# EasyEDA Pro project Main.eprj, board k230D
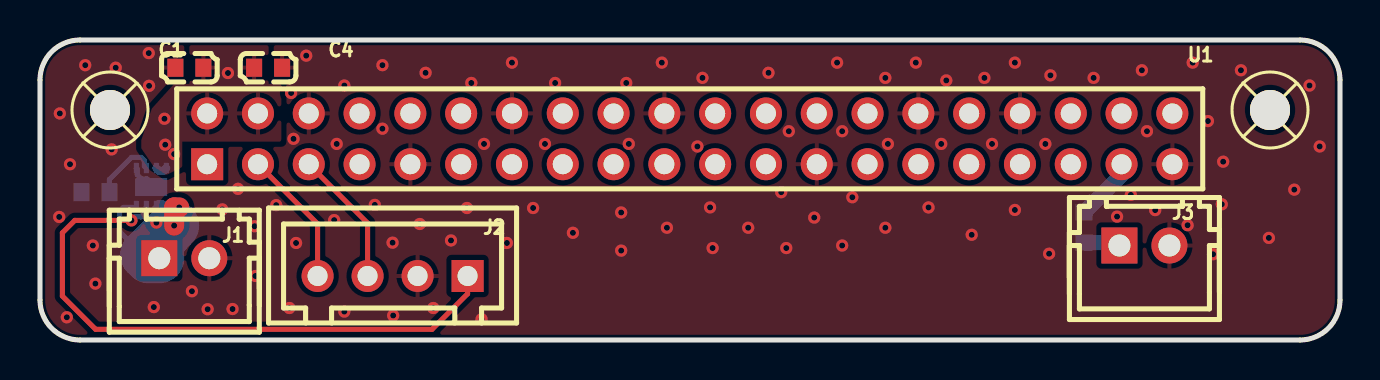
[diagram p12: board, top side]
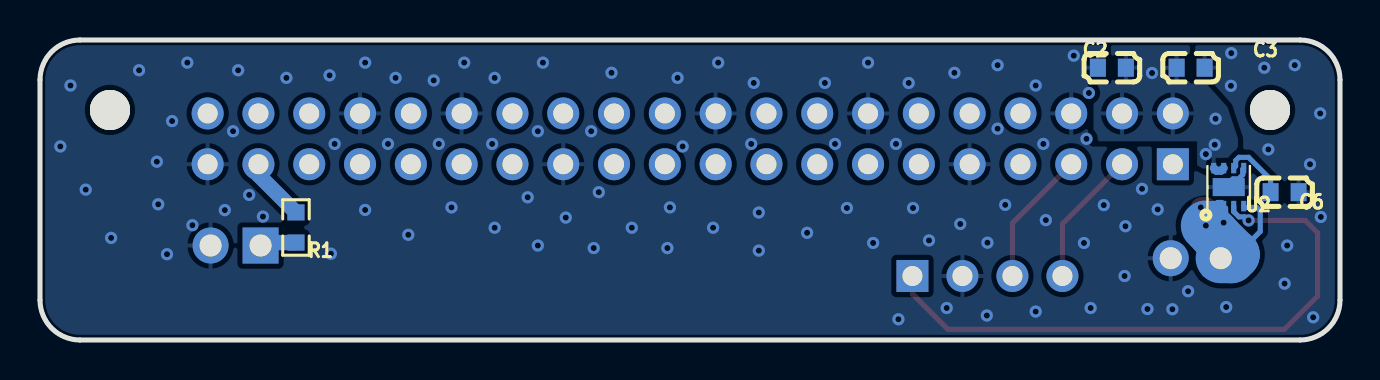
[diagram p13: board, bottom side, seen from below]

Outline 65 x 15 mm; copper layers: Top Layer, Bottom Layer. Coordinates in mm from the lower left corner of the outline.
Outline path: 0,13 arc(0.59,14.41) 2,15 63,15 arc(64.41,14.41) 65,13 65,2 arc(64.41,0.59) 63,0 2,0 arc(0.59,0.59) 0,2 0,13
Stack: Top Layer 0.035mm / Dielectric1 1.51mm FR4 er 4.5 / Bottom Layer 0.035mm

## Design rules (mm)
template: Custom Config
spacing copperThickness1oz (default): track to track 0.102, other pairs 0.152 to 0.3
spacing copperThickness2oz: track to track 0.203, other pairs 0.152 to 0.3
track width copperThickness1oz (default): min 0.127, default 0.254, max 7
track width copperThickness2oz: min 0.203, default 0.254, max 7
differential pair differentialPair (default): width min 0.127, default 0.254, max 2.54; gap min 0.152, default 0.152
via viaSize (default): diameter min 0.5, default 0.61, max 10; hole min 0.3, default 0.305, max 6.3

## Placement (name value [footprint] x y rotation side)
C1  100nF  [C0603]  7.47 13.61 180 top
C2  1uF  [C0603]  11.41 13.61 0 bottom
C3  22uF  [C0603]  7.47 13.61 180 bottom
C4  47uF  [C0603]  11.41 13.61 0 top
C6  10nF  [C0603]  2.77 7.39 0 bottom
J1  K230 pow  [CONN-TH_2P-P2.50_HX25003-2A]  7.22 4.09 0 top
J2  k230D UART  [CONN-TH_B4B-XH-A-BK-LF-SN]  17.63 3.2 180 top
J3  K230 buzzer  [CONN-TH_2P-P2.50_HX25003-2A]  55.22 4.72 0 top
R1  1kΩ  [R0603]  52.2 5.63 90 bottom
SCREW2  -  [Screw-Hole-M2]  61.5 11.5 180 top
SCREW4  -  [Screw-Hole-M2]  3.5 11.5 180 top
U1  FH-00148  [HDR-TH_40P-P2.54_FFH25405-D40S1001K6K]  32.49 10.06 0 top
U2  TPS22975DSGR  [WSON-8_L2.0-W2.0-P0.50-TL-EP]  5.56 7.64 90 bottom

## Footprints (pads in the part's own frame, mm; a bottom-side part is the same pattern mirrored in y, then rotated)
C0603
  rect 0.8x0.9 smd: 1(-0.7,0) 2(0.7,0)
CONN-TH_2P-P2.50_HX25003-2A
  rect 1.8x1.8 hole 1.1: 1(-1.25,0)
  round 1.8 hole 1.1: 2(1.25,0)
CONN-TH_B4B-XH-A-BK-LF-SN
  rect 1.6x1.6 hole 1: 1(-3.75,0)
  round 1.6 hole 1: 2(-1.25,0) 3(1.25,0) 4(3.75,0)
HDR-TH_40P-P2.54_FFH25405-D40S1001K6K
  rect 1.6x1.6 hole 1: 1(-24.13,-1.27)
  round 1.6 hole 1: 2(-24.13,1.27) 3(-21.59,-1.27) 4(-21.59,1.27) 5(-19.05,-1.27) 6(-19.05,1.27) 7(-16.51,-1.27) 8(-16.51,1.27) 9(-13.97,-1.27) 10(-13.97,1.27) 11(-11.43,-1.27) 12(-11.43,1.27) 13(-8.89,-1.27) 14(-8.89,1.27) 15(-6.35,-1.27) 16(-6.35,1.27) 17(-3.81,-1.27) 18(-3.81,1.27) 19(-1.27,-1.27) 20(-1.27,1.27) 21(1.27,-1.27) 22(1.27,1.27) 23(3.81,-1.27) 24(3.81,1.27) 25(6.35,-1.27) 26(6.35,1.27) 27(8.89,-1.27) 28(8.89,1.27) 29(11.43,-1.27) 30(11.43,1.27) 31(13.97,-1.27) 32(13.97,1.27) 33(16.51,-1.27) 34(16.51,1.27) 35(19.05,-1.27) 36(19.05,1.27) 37(21.59,-1.27) 38(21.59,1.27) 39(24.13,-1.27) 40(24.13,1.27)
R0603
  rect 0.806x0.864 smd: 1(-0.753,0) 2(0.753,0)
Screw-Hole-M2
  round 2 hole 2: 1(0,0)
WSON-8_L2.0-W2.0-P0.50-TL-EP
  rect 0.521x0.25 smd: 1(-0.95,0.75) 2(-0.95,0.25) 3(-0.95,-0.25) 4(-0.95,-0.75) 5(0.95,-0.75) 6(0.95,-0.25) 7(0.95,0.25) 8(0.95,0.75)
  rect 0.9x1.6 smd: 9(0,0)

## Nets
+5V: J1.1 U2.1 U2.2 U2.4
K230_ENABLE: J2.1 U2.3
K230D_BUZZER: R1.2 U1.37
K230RX: J2.4 U1.3
K230TX: J2.3 U1.5
POWER_GND: C1.2 C2.2 C3.2 C4.2 C6.1 J1.2 J2.2 J3.2 U1.6 U1.9 U1.14 U1.20 U1.25 U1.30 U1.34 U1.39 U2.5 U2.9
$1N12541: C1.1 C2.1 C3.1 C4.1 U1.2 U1.4 U2.7 U2.8
$1N12598: J3.1 R1.1
$1N87576: C6.2 U2.6

Pads without a net: SCREW2 1; SCREW4 1; U1 1 7 8 10 11 12 13 15 16 17 18 19 21 22 23 24 26 27 28 29 31 32 33 35 36 38 40

## Via types
v1: diameter 0.61, hole 0.305, Top Layer to Bottom Layer, 108 vias

## Routing (per net, layer and track width the routed paths; a pad name or vN(x,y) marks a point on that pad's centre or on a via; arc(x,y) is an arc through that point)
+5V: length 7.3
  Top Layer w1: v1(6.71,5.72) 6.71,6.63 v1(6.96,6.63)
  Bottom Layer w0.254: 4.57,4.84 3.99,5.42 3.99,6.45 4.17,6.63 4.75,6.63 U2.4 ; 5.72,6.6 5.72,6.38
  Bottom Layer w0.4: 5.92,6.8 6.09,6.8 6.2,6.69
  Bottom Layer w2.5: J1.1 5.45,4.09 5.26,4.27 5.28,4.27 6.28,5.27 6.28,5.29 v1(6.71,5.72)
  vias: v1(5.82,5.87)
K230_ENABLE: length 30.6
  Top Layer w0.254: v1(4.57,5.98) 1.74,5.98 1.12,5.36 1.12,2.2 2.78,0.53 19.6,0.53 21.38,2.31 J2.1
  Bottom Layer w0.254: v1(4.57,5.98) 4.6,5.98 4.77,6.16 5.05,6.16 5.31,6.42 U2.3
K230D_BUZZER: length 3.2
  Bottom Layer w0.762: U1.37 54.08,8.25 52.2,6.38
K230RX: length 6.8
  Top Layer w0.254: U1.3 13.88,5.81 J2.4
K230TX: length 6.8
  Top Layer w0.254: U1.5 16.38,5.85 J2.3
POWER_GND: length 1.4
  Bottom Layer w0.254: U2.9 5.56,7.84 5.35,8.06 5.07,8.06 4.86,8.27 4.86,8.55 U2.5
  vias: v1(0.99,11.33) v1(0.96,6.15) v1(1.34,1.14) v1(1.5,8.79) v1(2.26,13.74) v1(2.64,4.72) v1(2.77,2.82) v1(3.58,9.53) v1(3.79,13.61) v1(5.44,14.34) v1(5.45,12.71) v1(5.69,1.65) v1(7.6,2.44) v1(8.38,1.54) v1(9.12,6.53) v1(9.63,1.55) v1(9.9,7.56) v1(10.73,5.69) v1(10.77,3.2) v1(11.81,6.75) v1(12.47,1.6) v1(12.56,12.35) v1(12.68,10.06) v1(12.8,4.85) v1(13.31,14.22) v1(14.71,5.99) v1(14.84,9.8) v1(15.22,12.72) v1(15.22,1.42) v1(16.74,6.76) v1(17.12,13.74) v1(17.12,10.57) v1(17.63,4.87) v1(17.66,1.22) v1(18.99,5.8) v1(19.28,13.36) v1(19.66,1.6) v1(20.55,4.98) v1(21.35,6.6) v1(21.57,12.85) v1(22.08,1.04) v1(22.2,9.8) v1(23.34,4.85) v1(23.6,13.87) v1(24.66,6.6) v1(25.25,9.8) v1(25.76,12.85) v1(26.65,5.36) v1(29.06,6.38) v1(29.06,4.47) v1(29.31,12.85) v1(29.44,9.8) v1(31.09,13.87) v1(31.34,5.61) v1(32.87,9.68) v1(33.12,13.11) v1(33.5,6.63) v1(33.63,4.6) v1(35.41,5.61) v1(36.43,13.36) v1(37.06,7.39) v1(37.31,4.6) v1(37.44,10.44) v1(38.71,6.12) v1(39.85,13.87) v1(40.11,10.44) v1(40.11,4.72) v1(40.62,7.14) v1(42.27,13.11) v1(42.27,5.61) v1(42.39,9.8) v1(43.79,13.87) v1(44.43,6.63) v1(45.06,9.8) v1(45.31,12.98) v1(46.59,5.26) v1(47.22,13.11) v1(47.6,9.8) v1(48.74,13.87) v1(48.74,6.5) v1(50.27,9.8) v1(50.52,13.23) v1(50.46,4.31) v1(52.68,13.11) v1(53.85,6.17) v1(54.54,7.25) v1(55.09,13.49) v1(55.35,10.44) v1(55.76,6.49) v1(57.38,5.74) v1(57.63,13.87) v1(58.4,10.95) v1(58.65,4.29) v1(59.09,6.79) v1(59.16,8.92) v1(60.05,13.49) v1(61.44,5.11) v1(62.71,7.52) v1(63.48,12.72) v1(63.98,9.68)
$1N12541: length 0.6
  Bottom Layer w0.4: U2.7 5.95,8.46 6.18,8.46 U2.8
  vias: v1(6.22,11.06) v1(6.26,9.77) v1(6.71,9.3) v1(9.4,13.35)
$1N12598: length 1.9
  Bottom Layer w0.762: R1.1 53.57,4.87 53.97,4.47
$1N87576: length 3.3
  Bottom Layer w0.254: C6.2 3.47,8.03 4.57,9.13 5.05,9.13 5.22,8.97 5.22,8.69 U2.6

## Copper pours and planes (outline as drawn; the poured copper is in the pictures)
POWER_GND on Top Layer: -4.95,19.19 73.28,19.19 73.28,-8.5 -4.95,-8.5
POWER_GND on Bottom Layer: -4.06,18.68 71.63,18.68 71.63,-7.48 -4.06,-7.48
$1N12541 on Top Layer: 6.71,12.81 12.06,12.81 12.06,9.92 6.71,9.92
$1N12541 on Top Layer: 7.47,15 11.43,15 11.43,12.21 7.47,12.21
$1N12541 on Top Layer: 6.79,12.9 5.59,11.57 5.06,9.99 5.06,9.58 5.68,8.68 6.31,8.25 7.11,8.65 7.11,9.93 7.6,12.1
$1N12541 on Bottom Layer: 7.5,15.01 11.46,15.01 11.46,12.22 7.5,12.22
$1N12541 on Bottom Layer: 6.83,12.98 5.62,11.65 5.1,10.07 5.1,9.66 5.71,8.75 6.35,8.32 7.15,8.72 7.15,10 7.63,12.17
$1N12541 on Bottom Layer: 6.97,12.83 12.33,12.83 12.33,9.93 6.97,9.93
